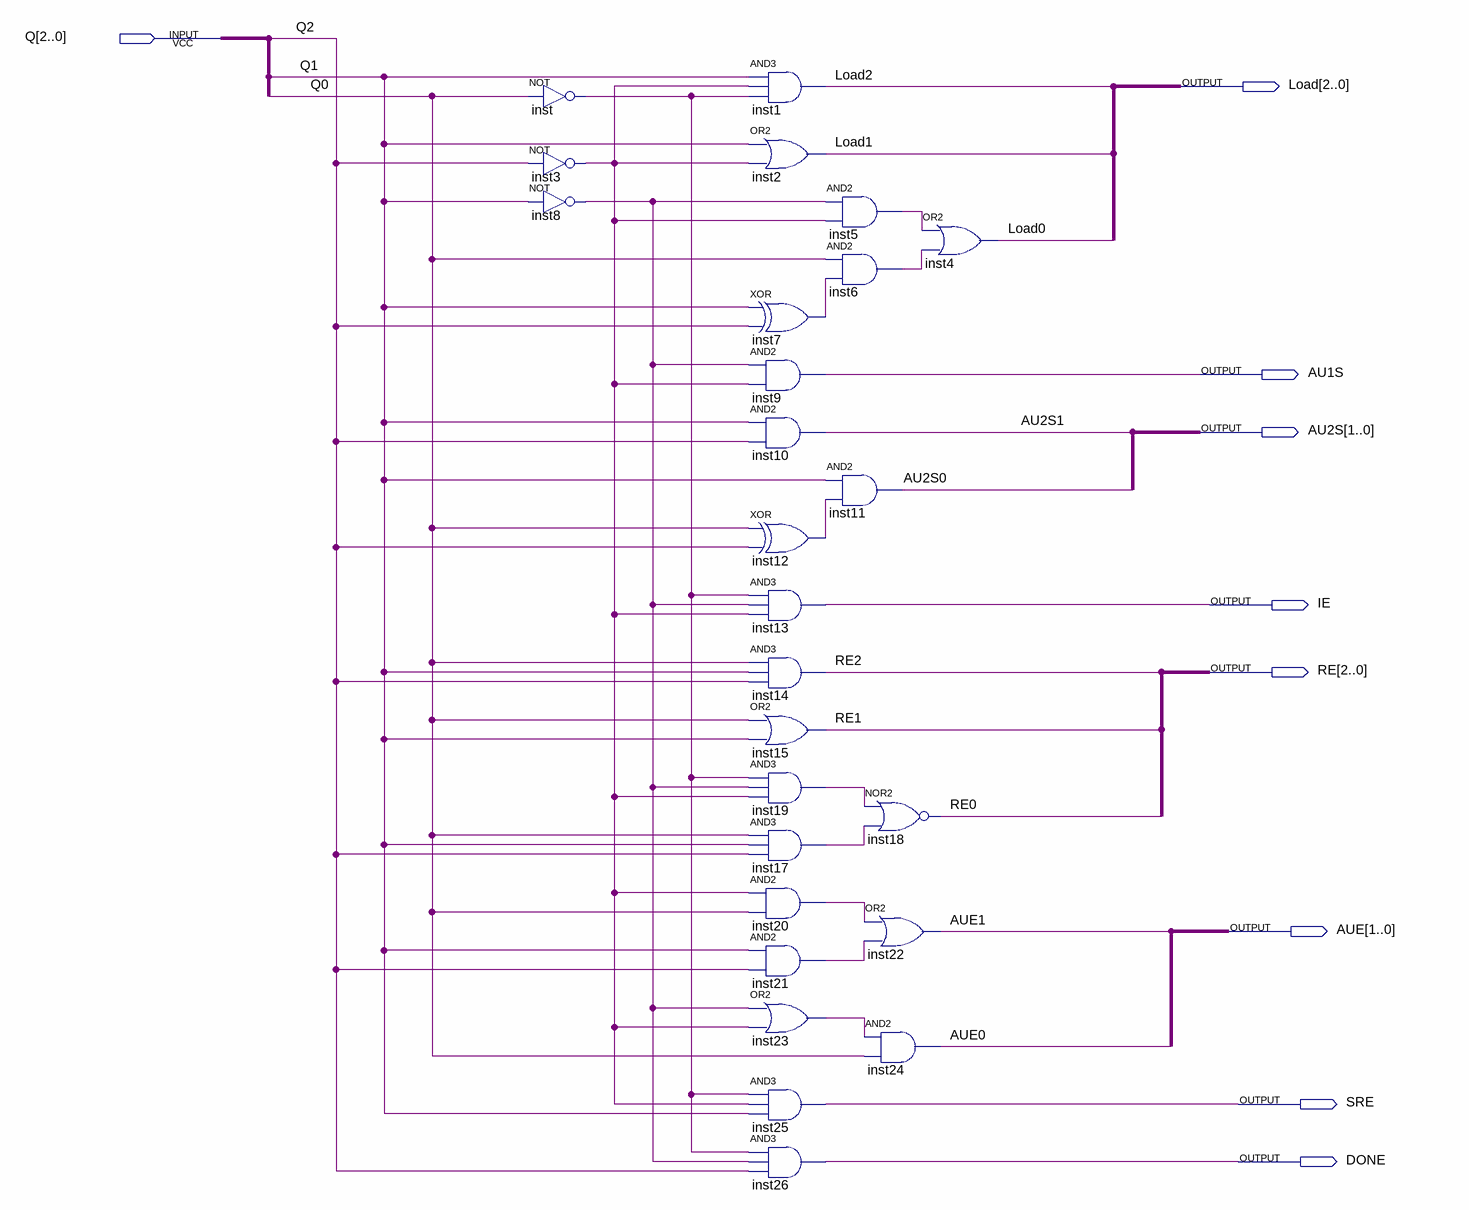
[diagram p0: schematic sheet]
// Quartus schematic OutputLogic.bdf as structural Verilog: 26 symbols, 9 pins
module OutputLogic (
  input  [2:0] Q,
  output [2:0] Load,
  output AU1S,
  output [1:0] AU2S,
  output IE,
  output [2:0] RE,
  output [1:0] AUE,
  output SRE,
  output DONE
);

  wire inst3_out, inst5_out, inst6_out, inst7_out, inst8_out, inst12_out, inst17_out, inst19_out, inst20_out,
       inst21_out, inst23_out, inst_out;

  not inst (inst_out, Q[0]);
  not inst3 (inst3_out, Q[2]);
  not inst8 (inst8_out, Q[1]);
  and inst1 (Load[2], Q[1], inst3_out, inst_out);
  or inst2 (Load[1], Q[1], inst3_out);
  xor inst7 (inst7_out, Q[1], Q[2]);
  and inst9 (AU1S, inst8_out, inst3_out);
  and inst10 (AU2S[1], Q[1], Q[2]);
  xor inst12 (inst12_out, Q[0], Q[2]);
  and inst13 (IE, inst_out, inst8_out, inst3_out);
  and inst14 (RE[2], Q[0], Q[1], Q[2]);
  or inst15 (RE[1], Q[0], Q[1]);
  and inst19 (inst19_out, inst_out, inst8_out, inst3_out);
  and inst17 (inst17_out, Q[0], Q[1], Q[2]);
  and inst20 (inst20_out, inst3_out, Q[0]);
  and inst21 (inst21_out, Q[1], Q[2]);
  or inst23 (inst23_out, inst8_out, inst3_out);
  and inst25 (SRE, inst_out, inst3_out, Q[1]);
  and inst26 (DONE, inst_out, inst8_out, Q[2]);
  and inst5 (inst5_out, inst8_out, inst3_out);
  and inst6 (inst6_out, Q[0], inst7_out);
  and inst11 (AU2S[0], Q[1], inst12_out);
  nor inst18 (RE[0], inst19_out, inst17_out);
  or inst22 (AUE[1], inst20_out, inst21_out);
  and inst24 (AUE[0], inst23_out, Q[0]);
  or inst4 (Load[0], inst5_out, inst6_out);
endmodule
